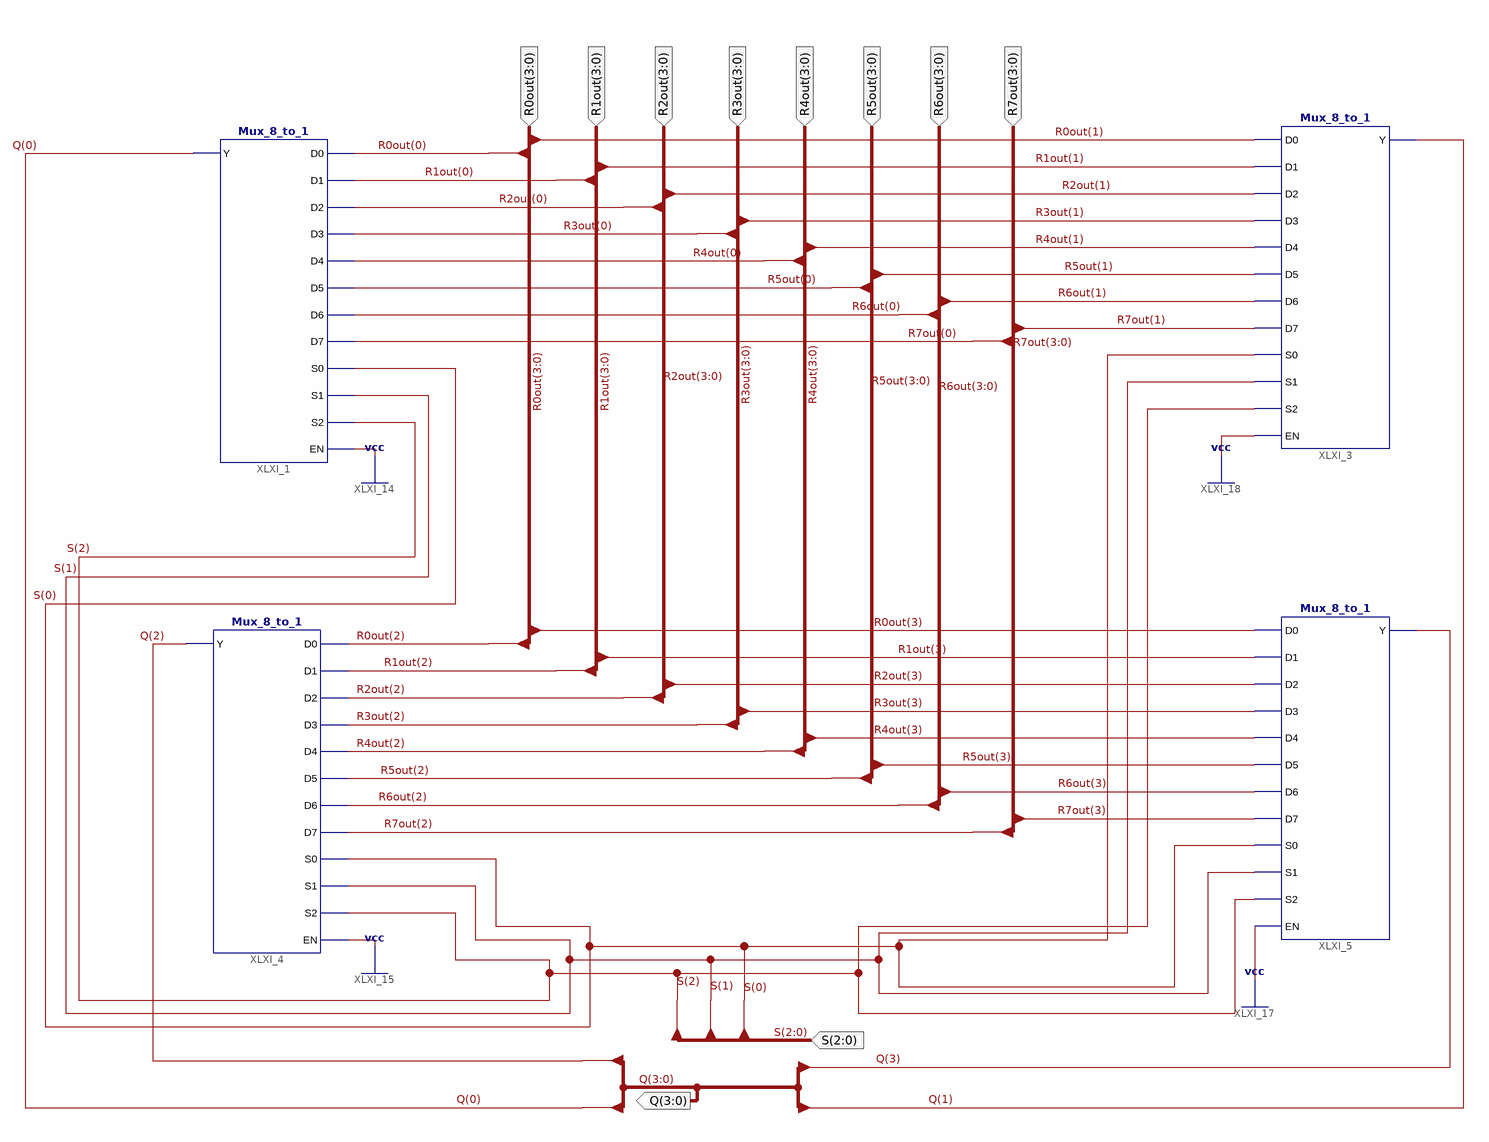
[diagram p0: schematic sheet 1]
// Xilinx ISE schematic Mux_8_1_4bit.sch (spartan3e) as structural Verilog: 4 symbols, 10 ports
module Mux_8_1_4bit (
  input  [3:0] R2out,
  input  [3:0] R3out,
  input  [3:0] R4out,
  input  [3:0] R5out,
  input  [3:0] R6out,
  input  [3:0] R7out,
  input  [3:0] R0out,
  input  [3:0] R1out,
  input  [2:0] S,
  output [3:0] Q
);

  Mux_8_to_1 XLXI_1 (
    .D0(R0out[0]), .D1(R1out[0]), .D2(R2out[0]), .D3(R3out[0]), .D4(R4out[0]), .D5(R5out[0]), .D6(R6out[0]),
    .D7(R7out[0]), .EN(1'b1), .S0(S[0]), .S1(S[1]), .S2(S[2]), .Y(Q[0]));
  Mux_8_to_1 XLXI_3 (
    .D0(R0out[1]), .D1(R1out[1]), .D2(R2out[1]), .D3(R3out[1]), .D4(R4out[1]), .D5(R5out[1]), .D6(R6out[1]),
    .D7(R7out[1]), .EN(1'b1), .S0(S[0]), .S1(S[1]), .S2(S[2]), .Y(Q[1]));
  Mux_8_to_1 XLXI_4 (
    .D0(R0out[2]), .D1(R1out[2]), .D2(R2out[2]), .D3(R3out[2]), .D4(R4out[2]), .D5(R5out[2]), .D6(R6out[2]),
    .D7(R7out[2]), .EN(1'b1), .S0(S[0]), .S1(S[1]), .S2(S[2]), .Y(Q[2]));
  Mux_8_to_1 XLXI_5 (
    .D0(R0out[3]), .D1(R1out[3]), .D2(R2out[3]), .D3(R3out[3]), .D4(R4out[3]), .D5(R5out[3]), .D6(R6out[3]),
    .D7(R7out[3]), .EN(1'b1), .S0(S[0]), .S1(S[1]), .S2(S[2]), .Y(Q[3]));
endmodule
